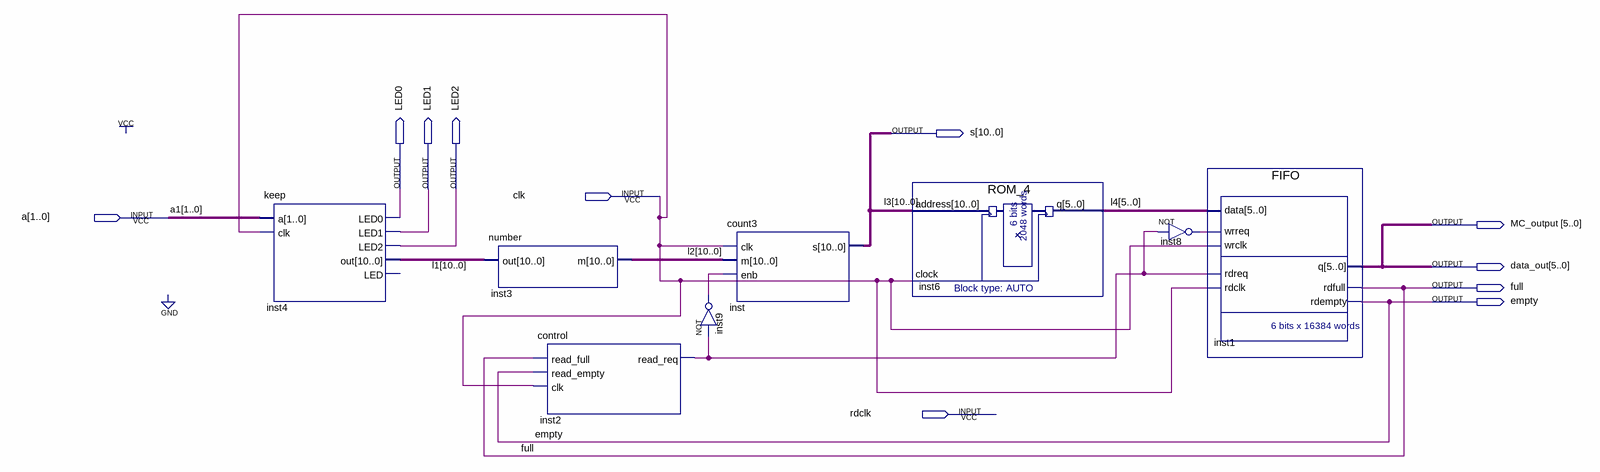
[diagram p0: schematic sheet]
// Quartus schematic Project_4_main.bdf as structural Verilog: 8 symbols, 11 pins
module Project_4_main (
  input  clk,
  input  [1:0] a,
  input  rdclk,
  output [10:0] s,
  output LED0,
  output LED1,
  output LED2,
  output [5:0] MC_output,
  output [5:0] data_out,
  output full,
  output empty
);

  wire inst2_read_req, inst8_out, inst9_out;
  wire [5:0] l4;
  wire [10:0] l1, l2;

  keep inst4 (.a(a), .clk(clk), .LED0(LED0), .LED1(LED1), .LED2(LED2), .out(l1));  // open: LED
  number inst3 (.out(l1), .m(l2));
  control inst2 (.read_full(full), .read_empty(empty), .clk(clk), .read_req(inst2_read_req));
  count3 inst (.clk(clk), .m(l2), .enb(inst9_out), .s(s));
  not inst9 (inst9_out, inst2_read_req);
  ROM_4 inst6 (.address(s), .clock(clk), .q(l4));
  not inst8 (inst8_out, inst2_read_req);
  FIFO inst1 (
    .data(l4), .wrreq(inst8_out), .wrclk(clk), .rdreq(inst2_read_req), .rdclk(clk), .q(data_out),
    .rdfull(full), .rdempty(empty));

  assign MC_output = data_out;

  // Other names for the same wires on the sheet: a1[1:0] = a; l3[10:0] = s
endmodule
